# EAGLE design Carte course en cours (EAGLE 8.7.0)
CNAME: https://github.com/heolfief/Course-en-Cours; CREVISION: A; DESIGNER: Heol Fief & Dylan Gageot
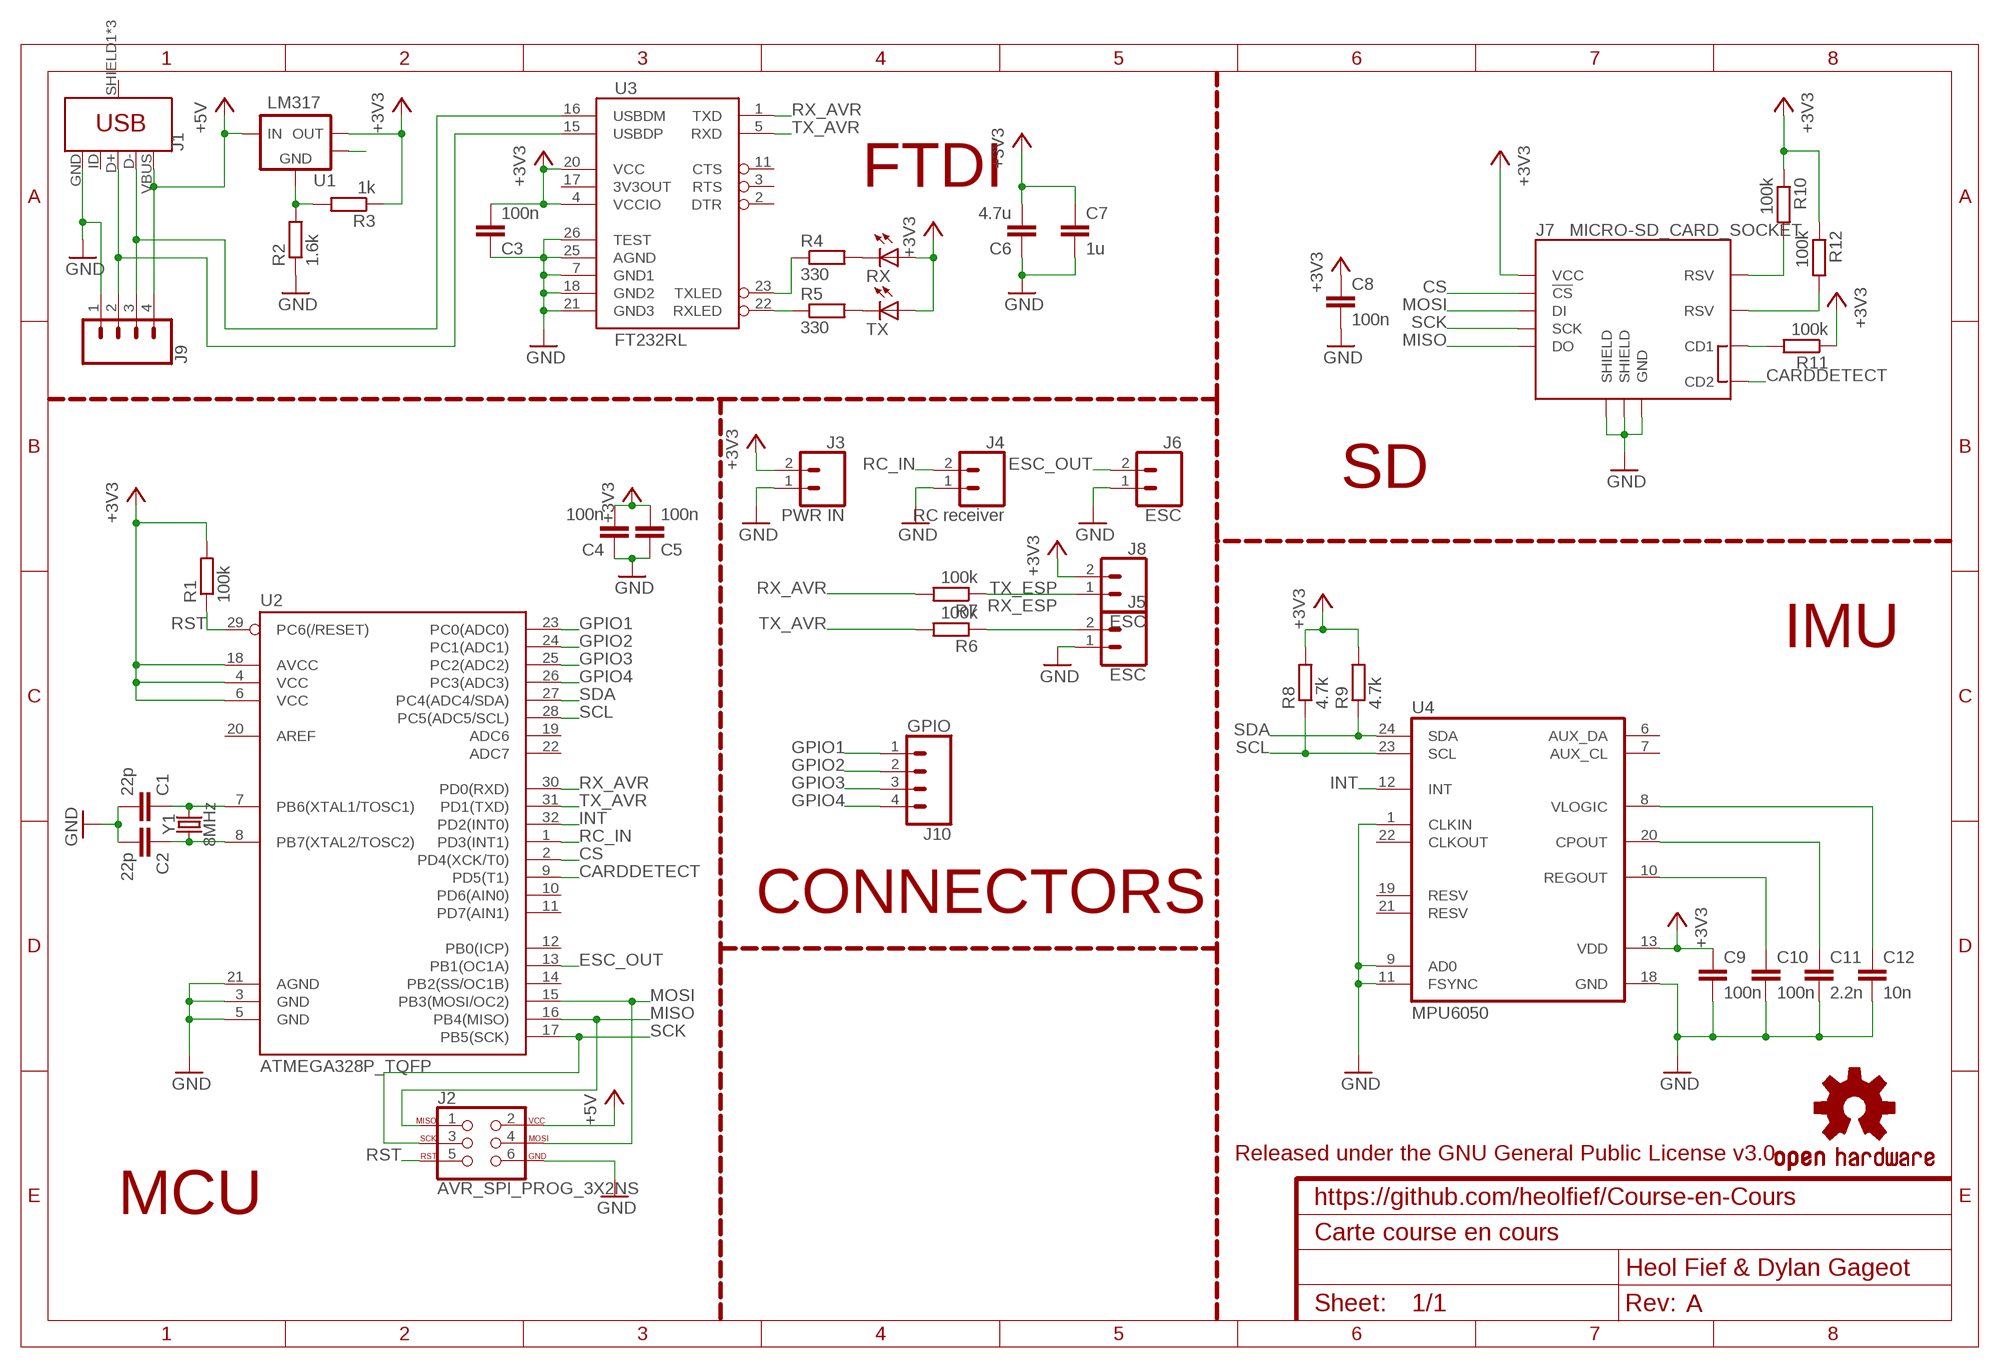
[diagram p0: schematic, sheet 1]

## Parts
C1  22p  C-EUC0805  [C0805]
C2  22p  C-EUC0805  [C0805]
C3  100n  C-EUC0805  [C0805]
C4  100n  C-EUC0805  [C0805]
C5  100n  C-EUC0805  [C0805]
C6  4.7u  C-EUC0805  [C0805]
C7  1u  C-EUC0805  [C0805]
C8  100n  C-EUC0805  [C0805]
C9  100n  C-EUC0805  [C0805]
C10  100n  C-EUC0805  [C0805]
C11  2.2n  C-EUC0805  [C0805]
C12  10n  C-EUC0805  [C0805]
J1  USB_MICRO-B_FEMALE-SMT  [USB-B-MICRO-SMD]
J2  AVR_SPI_PROG_3X2NS  [2X3-NS]
J3  PWR IN  CONN_02  [1X02]
J4  RC receiver  CONN_02  [1X02]
J5  ESC  CONN_02  [1X02]
J6  ESC  CONN_02  [1X02]
J7  MICRO-SD_CARD_SOCKET  [MICRO-SD-SOCKET]
J8  ESC  CONN_02  [1X02]
J9  CONN_04  [1X04]
J10  GPIO  CONN_04  [1X04]
LOGO1  OSHW-LOGOM  [OSHW-LOGO-M]
R1  100k  R-EU_R0805  [R0805]
R2  1.6k  R-EU_R0805  [R0805]
R3  1k  R-EU_R0805  [R0805]
R4  330  R-EU_R0805  [R0805]
R5  330  R-EU_R0805  [R0805]
R6  100k  R-EU_R0805  [R0805]
R7  100k  R-EU_R0805  [R0805]
R8  4.7k  R-EU_R0805  [R0805]
R9  4.7k  R-EU_R0805  [R0805]
R10  100k  R-EU_R0805  [R0805]
R11  100k  R-EU_R0805  [R0805]
R12  100k  R-EU_R0805  [R0805]
RX  LEDCHIPLED_0805  [CHIPLED_0805]
TX  LEDCHIPLED_0805  [CHIPLED_0805]
U1  LM317  LM1117-SOT223  [SOT-223-3]
U2  ATMEGA328P_TQFP  [TQFP32-08]
U3  FT232RL  FT232RL-BASICSSOP  [SSOP28DB]
U4  MPU6050  [HVQFN24_NS]
Y1  8MHz  CRYSTAL-8MHZSMD-5X3.2  [CRYSTAL-SMD-5X3.2-4PAD]

## Nets
+3V3: C3.2 C4.2 C5.2 C6.2 C7.1 C8.1 C9.1 J3.2 J7.VCC J8.2 R1.2 R3.1 R8.2 R9.2 R10.1 R11.1 R12.1 RX.A TX.A U1.2(VOUT) U2.4(VCC) U2.6(VCC) U2.18(AVCC) U3.4(VCCIO) U3.20(VCC) U4.13(VDD)
+5V: J1.VBUS J2.2 J9.4 U1.3(VIN)
CARDDETECT: J7.CD2 U2.9(PD5(T1))
CS: J7.CS(!CS) U2.2(PD4(XCK/T0))
ESC_OUT: J6.2 U2.13(PB1(OC1A))
GND: C1.2 C2.2 C3.1 C4.1 C5.1 C6.1 C7.2 C8.2 C9.2 C10.2 C11.2 C12.2 J1.GND J2.6 J3.1 J4.1 J5.1 J6.1 J7.GND J7.GND1(SHIELD) J7.GND3(SHIELD) J9.1 R2.1 U2.3(GND) U2.5(GND) U2.21(AGND) U3.7(GND1) U3.18(GND2) U3.21(GND3) U3.25(AGND) U3.26(TEST) U4.1(CLKIN) U4.9(AD0) U4.11(FSYNC) U4.18(GND)
GPIO1: J10.1 U2.23(PC0(ADC0))
GPIO2: J10.2 U2.24(PC1(ADC1))
GPIO3: J10.3 U2.25(PC2(ADC2))
GPIO4: J10.4 U2.26(PC3(ADC3))
HEATSINK: U1.4(HEATSINK)
INT: U2.32(PD2(INT0)) U4.12(INT)
MISO: J2.1 J7.DO U2.16(PB4(MISO))
MOSI: J2.4 J7.DI U2.15(PB3(MOSI/OC2))
N$1: R2.2 R3.2 U1.1(GND)
N$2: J1.D- J9.3 U3.16(USBDM)
N$5: C1.1 U2.7(PB6(XTAL1/TOSC1)) Y1.3
N$6: C2.1 U2.8(PB7(XTAL2/TOSC2)) Y1.1
N$7: J1.D+ J9.2 U3.15(USBDP)
N$10: C11.1 U4.20(CPOUT)
N$12: R4.1 U3.23(TXLED)
N$13: R5.1 U3.22(RXLED)
N$14: R4.2 RX.C
N$15: R5.2 TX.C
N$16: C10.1 U4.10(REGOUT)
N$18: C12.1 U4.8(VLOGIC)
N$27: J7.RSV1(RSV) R10.2
N$28: J7.RSV2(RSV) R12.2
N$29: J7.CD1 R11.2
RC_IN: J4.2 U2.1(PD3(INT1))
RST: J2.5 R1.1 U2.29(PC6(/RESET))
RX_AVR: R7.2 U2.30(PD0(RXD)) U3.1(TXD)
RX_ESP: J5.2 R6.1
SCK: J2.3 J7.SCLK(SCK) U2.17(PB5(SCK))
SCL: R8.1 U2.28(PC5(ADC5/SCL)) U4.23(SCL)
SDA: R9.1 U2.27(PC4(ADC4/SDA)) U4.24(SDA)
TX_AVR: R6.2 U2.31(PD1(TXD)) U3.5(RXD)
TX_ESP: J8.1 R7.1
Unconnected: J1.ID J1.SHIELD1(SHIELD) J1.SHIELD2(SHIELD) J1.SHIELD3(SHIELD) U2.10(PD6(AIN0)) U2.11(PD7(AIN1)) U2.12(PB0(ICP)) U2.14(PB2(SS/OC1B)) U2.19(ADC6) U2.20(AREF) U2.22(ADC7) U3.2(DTR) U3.3(RTS) U3.11(CTS) U3.17(3V3OUT) U4.6(AUX_DA) U4.7(AUX_CL) U4.19(RESV) U4.21(RESV) U4.22(CLKOUT)

## Notes on the sheet
- FTDI
- SD
- IMU
- CONNECTORS
- Released under the GNU General Public License v3.0
- MCU

## Library data of the parts
C1-C12 = rcl:C-EU: CAPACITOR, European symbol
J1 = SparkFun-Connectors:USB_MICRO-B: USB Type Micro-B Connector Male/female and PTH/SMT variants SparkFun Products: SparkFun microB USB Breakout <https://www.sparkfun.com/products/12035> SparkFun USB microB Plug Breakout <https://www.sparkfun.com/products/10031> SparkFun ESP8266 Thing <https://www.sparkfun.com/products/13231>; PROD_ID: CONN-11752
J2 = SparkFun-Connectors:AVR_SPI_PROG_3X2: AVR ISP 6 Pin This is the reduced ISP connector for AVR programming. Common on Arduino. This footprint will take up less PCB space and can be used with a 10-pin to 6-pin adapter such as SKU: BOB-08508 **Special note about "TEST_POINT" package. The stop mask is on the top side, so if you want your programming test points to be on the bottom of your board, make sure to place this package on the bottom side of the board. This also ensure that the orientation to program from the bottom side will be correct. SparkFun Products: SparkFun ISP Pogo Adapter <https://www.sparkfun.com/products/11591> - NS Tiny AVR Programmer <https://www.sparkfun.com/products/11801> -PTH
J3-J6 J8 = SparkFun-Connectors:CONN_02: Multi connection point. Often used as Generic Header-pin footprint for 0.1 inch spaced/style header connections On any of the 0.1 inch spaced packages, you can populate with these: Break Away Headers - Straight <https://www.sparkfun.com/products/116> (PRT-00116) Break Away Male Headers - Right Angle <https://www.sparkfun.com/products/553> (PRT-00553) Female Headers <https://www.sparkfun.com/products/115> (PRT-00115) Break Away Headers - Machine Pin <https://www.sparkfun.com/products/117> (PRT-00117) Break Away Female Headers - Swiss Machine Pin <https://www.sparkfun.com/products/743> (PRT-00743) For SCREWTERMINALS and SPRING TERMINALS visit here: Screw Terimnals on SparkFun.com <https://www.sparkfun.com/search/results?term=Screw+Terminals> (5mm/3.5mm/2.54mm spacing) This device is also useful as a general connection point to wire up your design to another part of your project. Our various solder wires solder well into these plated through hole pads. Hook-Up Wire - Assortment (Stranded, 22 AWG) <https://www.sparkfun.com/products/11375> (PRT-11375) Hook-Up Wire - Assortment (Solid Core, 22 AWG) <https://www.sparkfun.com/products/11367> (PRT-11367) View the entire wire category on our website here <https://www.sparkfun.com/categories/141> Special notes: Molex polarized connector foot print use with: PRT-08233 with associated crimp pins and housings. 2.54_SCREWTERM for use with PRT-10571. 3.5mm Screw Terminal footprints for PRT-08084 5mm Screw Terminal footprints for use with PRT-08432
J7 = SparkFun-Connectors:MICRO-SD_CARD_SOCKET: microSD Socket for Transflash Push-push type µSD socket. tDoc lines correctly indicate media card edge positions when inserting (unlocked, locked, depressed). NOTE: CD1 and CD2 are connected internally, and the default detect state of the socket is detect pin to ground. SparkFun Products: WAV Trigger <https://www.sparkfun.com/products/13660> CAN-Bus Shield <https://www.sparkfun.com/products/13262> SparkFun Level Shifing microSD Breakout <https://www.sparkfun.com/products/13743>; PROD_ID: CONN-07820; SF_ID: PRT-00127
J9 J10 = SparkFun-Connectors:CONN_04: Multi connection point. Often used as Generic Header-pin footprint for 0.1 inch spaced/style header connections On any of the 0.1 inch spaced packages, you can populate with these: Break Away Headers - Straight <https://www.sparkfun.com/products/116> (PRT-00116) Break Away Male Headers - Right Angle <https://www.sparkfun.com/products/553> (PRT-00553) Female Headers <https://www.sparkfun.com/products/115> (PRT-00115) Break Away Headers - Machine Pin <https://www.sparkfun.com/products/117> (PRT-00117) Break Away Female Headers - Swiss Machine Pin <https://www.sparkfun.com/products/743> (PRT-00743) For SCREWTERMINALS and SPRING TERMINALS visit here: Screw Terimnals on SparkFun.com <https://www.sparkfun.com/search/results?term=Screw+Terminals> (5mm/3.5mm/2.54mm spacing) This device is also useful as a general connection point to wire up your design to another part of your project. Our various solder wires solder well into these plated through hole pads. Hook-Up Wire - Assortment (Stranded, 22 AWG) <https://www.sparkfun.com/products/11375> (PRT-11375) Hook-Up Wire - Assortment (Solid Core, 22 AWG) <https://www.sparkfun.com/products/11367> (PRT-11367) View the entire wire category on our website here <https://www.sparkfun.com/categories/141> Special notes: Molex polarized connector foot print use with SKU : PRT-08231 with associated crimp pins and housings. 1MM SMD Version SKU: PRT-10208; PROD_ID: CONN-09696
LOGO1 = SparkFun-Aesthetics:OSHW-LOGO: Open-Source Hardware (OSHW) Logo This logo indicates the piece of hardware it is found on incorporates a OSHW license and/or adheres to the definition of open source hardware found here: http://freedomdefined.org/OSHW
R1-R12 = rcl:R-EU_: RESISTOR, European symbol
RX TX = led:LED: LED OSRAM: - CHIPLED LG R971, LG N971, LY N971, LG Q971, LY Q971, LO R971, LY R971 LH N974, LH R974 LS Q976, LO Q976, LY Q976 LO Q996 - Hyper CHIPLED LW Q18S LB Q993, LB Q99A, LB R99A - SideLED LS A670, LO A670, LY A670, LG A670, LP A670 LB A673, LV A673, LT A673, LW A673 LH A674 LY A675 LS A676, LA A676, LO A676, LY A676, LW A676 LS A679, LY A679, LG A679 - Hyper Micro SIDELED® LS Y876, LA Y876, LO Y876, LY Y876 LT Y87S - SmartLED LW L88C, LW L88S LB L89C, LB L89S, LG L890 LS L89K, LO L89K, LY L89K LS L896, LA L896, LO L896, LY L896 - TOPLED LS T670, LO T670, LY T670, LG T670, LP T670 LSG T670, LSP T670, LSY T670, LOP T670, LYG T670 LG T671, LOG T671, LSG T671 LB T673, LV T673, LT T673, LW T673 LH T674 LS T676, LA T676, LO T676, LY T676, LB T676, LH T676, LSB T676, LW T676 LB T67C, LV T67C, LT T67C, LS T67K, LO T67K, LY T67K, LW E67C LS E67B, LA E67B, LO E67B, LY E67B, LB E67C, LV E67C, LT E67C LW T67C LS T679, LY T679, LG T679 LS T770, LO T770, LY T770, LG T770, LP T770 LB T773, LV T773, LT T773, LW T773 LH T774 LS E675, LA E675, LY E675, LS T675 LS T776, LA T776, LO T776, LY T776, LB T776 LHGB T686 LT T68C, LB T68C - Hyper Mini TOPLED® LB M676 - Mini TOPLED Santana® LG M470 LS M47K, LO M47K, LY M47K Source: http://www.osram.convergy.de LUXEON: - LUMILED® LXK2-PW12-R00, LXK2-PW12-S00, LXK2-PW14-U00, LXK2-PW14-V00 LXK2-PM12-R00, LXK2-PM12-S00, LXK2-PM14-U00 LXK2-PE12-Q00, LXK2-PE12-R00, LXK2-PE12-S00, LXK2-PE14-T00, LXK2-PE14-U00 LXK2-PB12-K00, LXK2-PB12-L00, LXK2-PB12-M00, LXK2-PB14-N00, LXK2-PB14-P00, LXK2-PB14-Q00 LXK2-PR12-L00, LXK2-PR12-M00, LXK2-PR14-Q00, LXK2-PR14-R00 LXK2-PD12-Q00, LXK2-PD12-R00, LXK2-PD12-S00 LXK2-PH12-R00, LXK2-PH12-S00 LXK2-PL12-P00, LXK2-PL12-Q00, LXK2-PL12-R00 Source: www.luxeon.com KINGBRIGHT: KA-3528ASYC Source: www.kingbright.com
U1 = bt_regulator:LM1117: LDO Voltage Regulator NCP1117 Output Current in Excess of 1.0 A 1.2 V Maximum Dropout Voltage at 800 mA Over Temperature Fixed Output Voltages of 1.5, 1.8, 1.9, 2.0, 2.5, 2.85, 3.3, 5.0, and 12 V Adjustable Output Voltage Option No Minimum Load Requirement for Fixed Voltage Output Devices Reference/Output Voltage Trimmed to ±1.0% Current Limit, Safe Operating and Thermal Shutdown Protection Operation to 20 V Input NCV Prefix for Automotive and Other Applications Requiring Unique Site and Control Change Requirements; AEC−Q100 Qualified and PPAP Capable datasheet.pdf <http://www.onsemi.com/pub/Collateral/NCP1117-D.PDF> LM1117 Available in 1.8 V, 2.5 V, 3.3 V, 5 V, and adjustable versions Output Current 800 mA Current Limiting and Thermal Protection Space-Saving SOT-223 and WSON Packages Line Regulation 0.2% (Maximum) Load Regulation 0.4% (Maximum) Temperature: LM1117: 0°C to 125°C; LM1117I: −40°C to 125°C LM1117 (Rev. N) is a series of low dropout voltage regulators of 1.2V at 800mA of load current. It has the same pin-out as Texas Instruments' industry standard LM317. The LM1117-N is available in an adjustable version, available in five fixed voltages, 1.8V, 2.5V, 2.85V, 3.3V, and 5V. The LM1117-N offers current limiting and thermal shutdown. Its circuit includes a zener trimmed to within ±1%. datasheet.pdf <http://www.ti.com/lit/ds/symlink/lm1117.pdf>
U2 = SparkFun-IC-Microcontroller:ATMEGA328P_TQFP: Popular 328P in QFP Storefront component: ATmega328 - TQFP <https://www.sparkfun.com/products/13448> (COM-13448) Datasheet <http://www.sparkfun.com/datasheets/Components/SMD/ATMega328.pdf> SparkFun Products SparkFun RedBoard - Programmed with Arduino <https://www.sparkfun.com/products/12757> (DEV-12757) Arduino Pro Mini 328 - 5V/16MHz <https://www.sparkfun.com/products/11113> (DEV-11113) Arduino Pro Mini 328 - 3.3V/8MHz <https://www.sparkfun.com/products/11114> (DEV-11114) SparkFun OpenLog <https://www.sparkfun.com/products/13712> (DEV-13712) SparkFun MicroView - OLED Arduino Module <https://www.sparkfun.com/products/12923> (DEV-12923) SparkFun Digital Sandbox <https://www.sparkfun.com/products/12651> (DEV-12651) SparkFun PicoBoard <https://www.sparkfun.com/products/11888> (WIG-11888) Arduino Fio <https://www.sparkfun.com/products/10116> (DEV-10116) LilyPad Arduino 328 Main Board <https://www.sparkfun.com/products/13342> (DEV-13342) SparkFun RedStick <https://www.sparkfun.com/products/13741> (DEV-13741) LilyPad MP3 <https://www.sparkfun.com/products/11013> (DEV-11013) LilyPad Arduino SimpleSnap <https://www.sparkfun.com/products/10941> (DEV-10941) SparkFun Stepoko <https://www.sparkfun.com/products/13899> (ROB-13899) SparkFun Geiger Counter <https://www.sparkfun.com/products/11345> (SEN-11345) SparkFun EL Sequencer <https://www.sparkfun.com/products/12781> (COM-12781) Arduino Pro 328 - 5V/16MHz <https://www.sparkfun.com/products/10915> (DEV-10915) CryptoCape <https://www.sparkfun.com/products/12773> (DEV-12773) SparkFun IR Thermometer Evaluation Board - MLX90614 <https://www.sparkfun.com/products/10740> (SEN-10740) SparkFun RedBot Mainboard <https://www.sparkfun.com/products/12097> (ROB-12097) Arduino Pro 328 - 3.3V/8MHz <https://www.sparkfun.com/products/10914> (DEV-10914) SparkFun Block for Intel® Edison - Arduino <https://www.sparkfun.com/products/13036> (DEV-13036) SparkFun Simon Says - Surface Mount Soldering Kit <https://www.sparkfun.com/products/10935> (KIT-10935) SparkFun 7-Segment Serial Display - Red <https://www.sparkfun.com/products/11441> (COM-11441) SparkFun 7-Segment Serial Display - White <https://www.sparkfun.com/products/11629> (COM-11629) SparkFun 7-Segment Serial Display - Yellow <https://www.sparkfun.com/products/11443> (COM-11443) SparkFun 7-Segment Serial Display - Kelly Green <https://www.sparkfun.com/products/11440> (COM-11440) SparkFun 7-Segment Serial Display - Blue <https://www.sparkfun.com/products/11442> (COM-11442) SparkFun OpenSegment Serial Display - 20mm (Blue) <https://www.sparkfun.com/products/11647> (COM-11647) SparkFun OpenSegment Serial Display - 20mm (Green) <https://www.sparkfun.com/products/11646> (COM-11646) SparkFun OpenSegment Serial Display - 20mm (White) <https://www.sparkfun.com/products/11648> (COM-11648) SparkFun OpenSegment Serial Display - 20mm (Red) <https://www.sparkfun.com/products/11644> (COM-11644) SparkFun OpenSegment Serial Display - 20mm (Yellow) <https://www.sparkfun.com/products/11645> (COM-11645) SparkFun OpenSegment Shield <https://www.sparkfun.com/products/13190> (DEV-13190); PROD_ID: IC-09069
U3 = SparkFun-IC-Comms:FT232RL-BASIC: FT232RL USB UART This is the simplified version of the FT232RL unit. Only what you need, nothing you don't. FT232RL 4th Generation USB UART (USB <-> Serial) Controller. Datasheet <http://www.sparkfun.com/datasheets/IC/FT232R_v104.pdf> SparkFun Products Component <https://www.sparkfun.com/products/650> (COM-00650) SparkFun RedBot Mainboard <https://www.sparkfun.com/products/12097> (ROB-12097) SparkFun FTDI Basic Breakout - 5V <https://www.sparkfun.com/products/9716> (DEV-09716) SparkFun FTDI Basic Breakout - 3.3V <https://www.sparkfun.com/products/9873> (DEV-09873) Bus Pirate - v3.6a <https://www.sparkfun.com/products/12942> (TOL-12942) SparkFun USB to Serial Breakout - FT232RL <https://www.sparkfun.com/products/12731> (BOB-12731) SparkFun PicoBoard <https://www.sparkfun.com/products/11888> (WIG-11888) SparkFun RFID USB Reader <https://www.sparkfun.com/products/9963> (SEN-09963) LilyPad FTDI Basic Breakout - 5V <https://www.sparkfun.com/products/10275> (DEV-10275) SparkFun Stepoko <https://www.sparkfun.com/products/13899> (ROB-13899); PROD_ID: IC-00870
U4 = invensense:MPU6050: 6-Axis Motion Sensor I2C interface only
Y1 = SparkFun-Clocks:CRYSTAL-8MHZ: 8MHz Crystal Datasheet Example <http://www.futureelectronics.com/en/technologies/electromechanical/timing-devices/crystals/Pages/6008189-ABM3B-8.000MHZ-B2-T.aspx?IM=0> Frequency: 8MHz Frequency Tolerance: ±20ppm Load Capacitance: 18pF SparkFun Products: Pro Micro -3.3V/8MHz <https://www.sparkfun.com/products/12587> WAV Trigger <https://www.sparkfun.com/products/13660>; PROD_ID: XTAL-09431

## Board
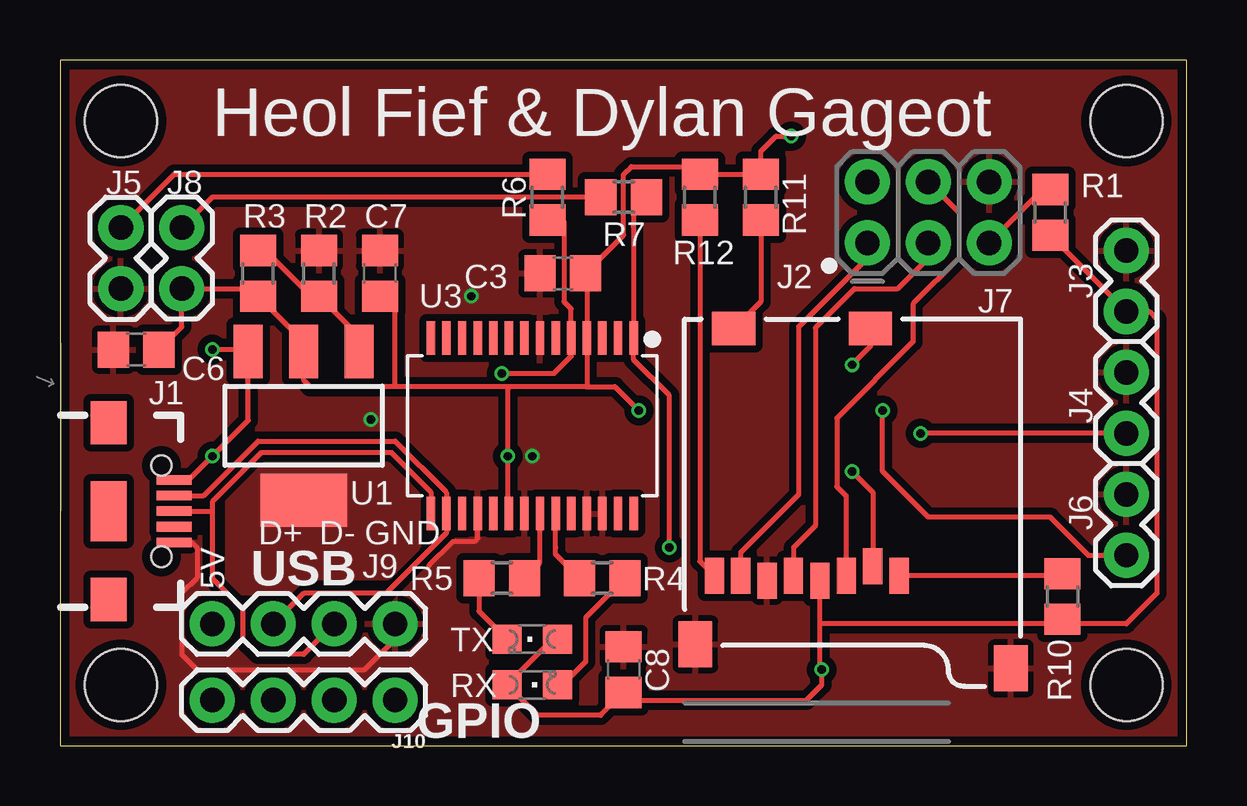
[diagram p1: board, top side]
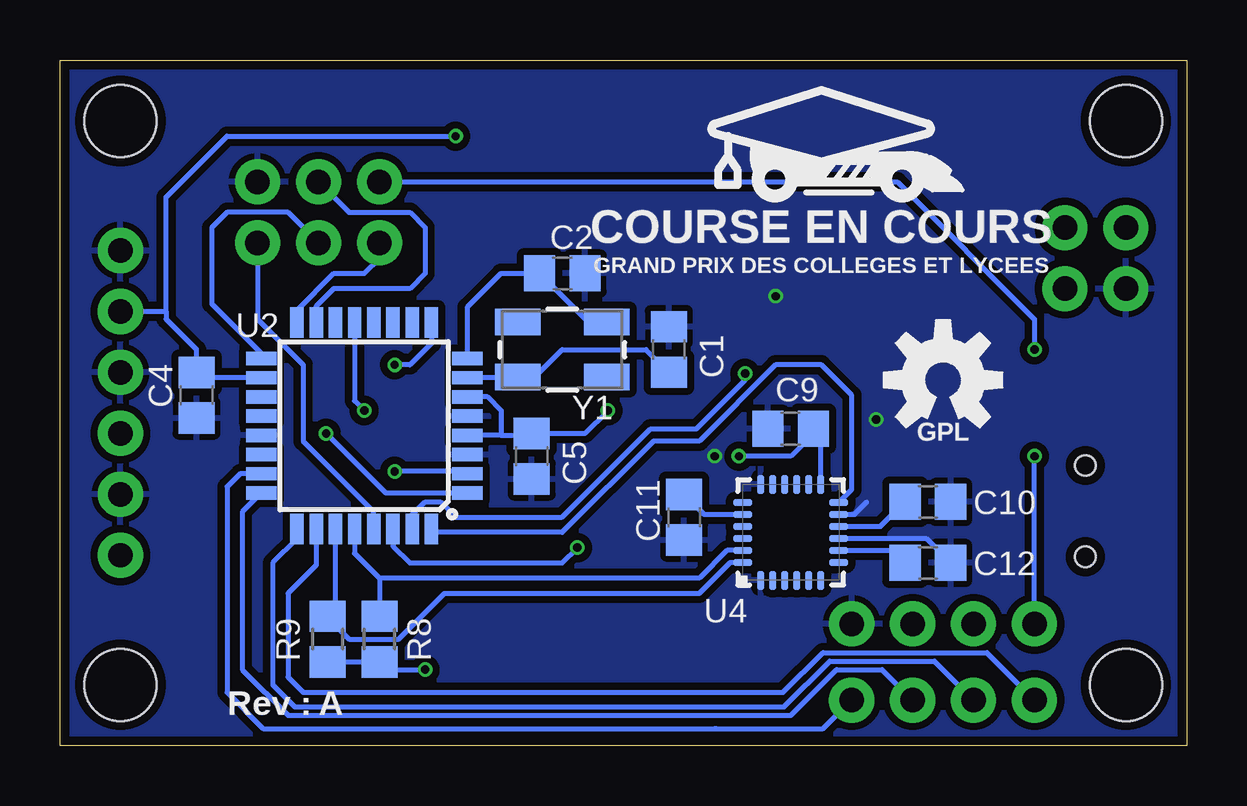
[diagram p2: board, bottom side, seen from below]

Size 46.97 x 28.57 mm. Coordinates in mm from the lower left corner, seen from the top.
Outline: 0,0 46.97,0 46.97,28.57 0,28.57 0,0
Copper layers (1*16): Top 0.035559375mm / dielectric 1.6mm / Bottom 0.035559375mm
Design rules "oshpark-2layer": minimum track width 6mil, minimum drill 10mil, track to track 6mil, track to pad 6mil, pad to pad 6mil, via to via 6mil, smd to smd 6mil, copper to edge 15mil, drill to drill 6mil, minimum pad ring 5mil, minimum via ring 5mil, stop-mask expansion 2.5mil, vias tented up to drill 0mil, thermal gap 10mil
Holes 3 mm at 2.54,2.54 44.45,2.54 2.54,26.04 44.45,26.04

### Footprints (pad centres in the part's own frame; a part is rotated, then mirrored left to right if it is on the bottom)
C0805 = smd 1.3 x 1.5: 1 -0.95,0; 2 0.95,0
USB-B-MICRO-SMD = smd 1.45 x 0.4: D+ 2.725,0; D- 2.725,0.65; GND 2.725,-1.3; ID 2.725,-0.65; VBUS 2.725,1.3 | smd 1.5 x 1.8: SHIELD1 0,3.685; SHIELD2 0,-3.685 | smd 1.5 x 2.5: SHIELD3 0,0 | hole 0.85: 2.2,1.9; 2.2,-1.9
2X3-NS = drill 1.016 pad 1.88: 1 -2.54,-1.27; 2 -2.54,1.27; 3 0,-1.27; 4 0,1.27; 5 2.54,-1.27; 6 2.54,1.27
1X02 = drill 1.016 pad 1.88: 1 0,0; 2 2.54,0
MICRO-SD-SOCKET = smd 1.8 x 1.4: CD1 -2.05,0.4; CD2 -7.75,0.4 | smd 0.8 x 1.5: CS -7.84,10.3; DI -6.74,10.7; DO -2.34,10.7; GND -3.44,10.9; RSV1 -8.94,10.7; RSV2 -1.24,10.7; SCLK -4.54,10.7; VCC -5.64,10.9 | smd 1.4 x 1.9: GND1 -13.6,14.55; GND3 -0.45,13.55
1X04 = drill 1.016 pad 1.88: 1 0,0; 2 2.54,0; 3 5.08,0; 4 7.62,0
R0805 = smd 1.3 x 1.5: 1 -0.95,0; 2 0.95,0
CHIPLED_0805 = smd 1.2 x 1.2: A 0,-1.05; C 0,1.05
SOT-223-3 = smd 1.219 x 2.235: 1 -2.311,-3.099; 2 0,-3.099; 3 2.311,-3.099 | smd 3.6 x 2.2: 4 0,3.099
TQFP32-08 = smd 1.27 x 0.559: 1 -4.293,2.8; 2 -4.293,2; 3 -4.293,1.2; 4 -4.293,0.4; 5 -4.293,-0.4; 6 -4.293,-1.2; 7 -4.293,-2; 8 -4.293,-2.8; 17 4.293,-2.8; 18 4.293,-2; 19 4.293,-1.2; 20 4.293,-0.4; 21 4.293,0.4; 22 4.293,1.2; 23 4.293,2; 24 4.293,2.8 | smd 0.559 x 1.27: 9 -2.8,-4.293; 10 -2,-4.293; 11 -1.2,-4.293; 12 -0.4,-4.293; 13 0.4,-4.293; 14 1.2,-4.293; 15 2,-4.293; 16 2.8,-4.293; 25 2.8,4.293; 26 2,4.293; 27 1.2,4.293; 28 0.4,4.293; 29 -0.4,4.293; 30 -1.2,4.293; 31 -2,4.293; 32 -2.8,4.293
SSOP28DB = smd 0.348 x 1.397: 1 -4.225,-3.656; 2 -3.575,-3.656; 3 -2.925,-3.656; 4 -2.275,-3.656; 5 -1.625,-3.656; 6 -0.975,-3.656; 7 -0.325,-3.656; 8 0.325,-3.656; 9 0.975,-3.656; 10 1.625,-3.656; 11 2.275,-3.656; 12 2.925,-3.656; 13 3.575,-3.656; 14 4.225,-3.656; 15 4.225,3.656; 16 3.575,3.656; 17 2.925,3.656; 18 2.275,3.656; 19 1.625,3.656; 20 0.975,3.656; 21 0.325,3.656; 22 -0.325,3.656; 23 -0.975,3.656; 24 -1.625,3.656; 25 -2.275,3.656; 26 -2.925,3.656; 27 -3.575,3.656; 28 -4.225,3.656
HVQFN24_NS = smd 0.8 x 0.3: 1 -2,1.25; 2 -2,0.75; 3 -2,0.25; 4 -2,-0.25; 5 -2,-0.75; 6 -2,-1.25; 13 2,-1.25; 14 2,-0.75; 15 2,-0.25; 16 2,0.25; 17 2,0.75; 18 2,1.25 | smd 0.3 x 0.8: 7 -1.25,-2; 8 -0.75,-2; 9 -0.25,-2; 10 0.25,-2; 11 0.75,-2; 12 1.25,-2; 19 1.25,2; 20 0.75,2; 21 0.25,2; 22 -0.25,2; 23 -0.75,2; 24 -1.25,2
CRYSTAL-SMD-5X3.2-4PAD = smd 1.9 x 1.1: 1 -1.85,-1.15; 2 1.85,-1.15; 3 1.85,1.15; 4 -1.85,1.15

### Placement (x,y rotation side)
C1  21.59,16.51 90 bottom
C2  26.04,19.68 0 bottom
C3  20.95,19.68 0 top
C4  41.27,14.61 90 bottom
C5  27.3,12.06 90 bottom
C6  3.17,16.51 0 top
C7  13.34,19.68 90 top
C8  23.5,3.17 90 top
C9  16.51,13.21 180 bottom
C10  10.79,10.16 0 bottom
C11  20.95,9.53 270 bottom
C12  10.79,7.62 0 bottom
J1  2.03,9.78 0 top
J2  36.2,22.23 0 top
J3  44.45,20.64 270 top
J4  44.45,15.56 270 top
J5  2.54,19.05 90 top
J6  44.45,10.48 270 top
J7  26.04,17.78 180 top
J8  5.08,21.59 270 top
J9  13.97,5.08 180 top
J10  13.97,1.91 180 top
LOGO1  10.16,15.24 0 bottom
R1  41.27,22.23 270 top
R2  10.79,19.68 270 top
R3  8.26,19.68 90 top
R4  22.61,6.99 0 top
R5  18.41,6.99 180 top
R6  20.32,22.86 270 top
R7  23.5,22.86 0 top
R8  33.66,4.45 270 bottom
R9  35.81,4.45 270 bottom
R10  41.78,6.22 90 top
R11  29.21,22.86 270 top
R12  26.67,22.86 270 top
RX  19.68,2.54 270 top
TX  19.68,4.45 90 top
U1  10.16,13.34 180 top
U2  34.29,13.34 180 bottom
U3  19.68,13.34 180 top
U4  16.51,8.89 90 bottom
Y1  26.04,16.51 180 bottom

### Tracks (layer width: path | path; a pad name or v marks a point on that pad's centre or on a via)
+3V3  (via drill 0.35)
  Top 0.203: C6.2 5.08,17.46 J8.2 7.94,19.05 R3.1 10.16,16.83 U1.2 10.16,15.24 10.44,14.96 13.97,14.96 | R11.1 R12.1 26.36,23.81 26.04,24.13 23.81,24.13 23.5,23.81 23.5,21.27 C3.2 21.96,19.63 U3.4 21.96,15.02 21.91,14.96 | R11.1 29.52,23.5 | U3.20 18.71,9.53 18.67,9.57 v18.67,12.06 18.67,14.9 18.73,14.96 | TX.A 20.54,4.45 RX.A 19.91,1.27 22.54,1.27 23.34,2.06 | C8.1 23.34,2.06 | 31.68,5.08 J7.VCC | 23.34,2.06 23.5,1.91 31.11,1.91 31.75,2.54 v31.75,3.17 31.68,3.25 31.68,5.08 | 41.75,5.24 R10.1 | 41.75,5.24 41.59,5.08 31.68,5.08 | R11.1 29.21,24.77 29.84,25.4 v30.48,25.4 | 41.75,5.24 41.91,5.08 44.45,5.08 45.72,6.35 45.72,17.78 45.4,18.1 J3.2 R1.2 | 18.73,14.96 13.97,14.96 | 13.97,14.96 13.97,18.1 C7.1 | 21.91,14.96 18.73,14.96 | 21.91,14.96 23.14,14.96 v24.13,13.97
  Bottom 0.203: R9.2 R8.2 33.34,3.17 v31.75,3.17 | 42.55,18.1 42.55,17.78 41.27,16.51 C4.2 41.05,15.34 U2.18 | 28.57,12.94 27.39,12.94 C5.2 25.09,13.02 v24.13,13.97 | 28.57,12.94 U2.4 | v30.48,25.4 40.01,25.4 42.55,22.86 42.55,18.1 | U2.6 29.14,14.54 28.57,13.97 28.57,12.94 | U4.13 15.26,13.04 C9.1 15.56,13.02 16.51,12.06 v18.67,12.06 | J3.2 42.55,18.1
+5V  (via drill 0.35)
  Top 0.203: J1.VBUS 5.36,11.08 v6.35,12.06 7.85,13.56 U1.3 7.77,16.51 v6.35,16.51
  Bottom 0.203: J9.4 v6.35,12.06 | J2.2 12.06,23.5 6.35,17.78 v6.35,16.51
CARDDETECT  (via drill 0.35)
  Top 0.203: J7.CD2 33.78,16.64 v33.02,15.88
  Bottom 0.203: U2.9 31.49,16.77 32.38,15.88 v33.02,15.88
CS  (via drill 0.35)
  Top 0.203: v33.02,11.43 33.88,10.57 J7.CS
  Bottom 0.203: U2.2 30.09,11.43 v33.02,11.43
ESC_OUT  (via drill 0.35)
  Top 0.203: J6.2 42.86,7.94 41.27,9.53 36.2,9.53 34.29,11.43 v34.29,13.97
  Bottom 0.203: U2.13 34.69,14.37 v34.29,13.97
GND  (via drill 0.35)
  Top 0.203: U3.18 17.41,8.65 17.27,8.51 16.38,8.51 15.37,7.49 | J1.GND 5.49,8.48 5.71,8.26 5.71,6.99 5.08,6.35 5.08,3.81 5.71,3.17 12.7,3.17 13.97,4.45 J9.1
  Bottom 0.203: U4.11 13.86,9.64 13.34,10.16 | U4.9 10.87,8.64 C12.2
  other vias: 17.14,18.73 12.95,13.59 19.68,12.06
  pour Top (isolate 0.305, rank 2): 0,28.57 46.99,28.57 46.99,0 0,0
  pour Bottom (isolate 0.305, rank 2): 0,28.57 46.99,28.57 46.99,0 0,0
GPIO1
  Bottom 0.203: U2.23 39.47,11.34 40.01,10.79 40.01,2.22 38.49,0.71 19.68,0.71 19.61,0.71 15.16,0.71 J10.1
GPIO2
  Bottom 0.203: U2.24 39.37,9.75 39.37,3.17 37.47,1.27 16.51,1.27 14.61,3.17 12.7,3.17 J10.2
GPIO3
  Bottom 0.203: U2.25 37.09,8.63 38.1,7.62 38.1,2.54 37.19,1.63 16.79,1.63 14.88,3.53 10.52,3.53 J10.3
GPIO4
  Bottom 0.203: U2.26 36.29,7.53 37.47,6.35 37.47,2.86 36.83,2.22 23.5,2.22 23.18,2.22 16.83,2.22 15.16,3.89 8.33,3.89 J10.4
HEATSINK
  pour Top (no thermals): 6.99,10.16 8.57,11.75 13.65,11.75 14.92,10.48 14.92,8.26 13.65,6.99 10.16,6.99 9.53,6.35 7.62,6.35 6.99,6.99
INT
  Bottom 0.203: U4.12 13.97,10.68 13.97,14.61 15.24,15.88 17.14,15.88 20.32,12.7 22.23,12.7 26.04,8.89 31.34,8.89 U2.32
MISO
  Top 0.203: J2.1 33.66,20.32 30.8,17.46 30.8,10.48 28.38,8.05 J7.DO
  Bottom 0.203: U2.16 37.09,18.16 35.56,19.68 34.29,19.68 33.66,20.32 J2.1
MOSI
  Top 0.203: J7.DI 32.77,10.4 32.38,10.79 32.38,13.65 35.56,16.83 35.56,18.41 37.47,20.32 37.47,22.23 J2.4
  Bottom 0.203: J2.4 34.92,22.23 32.38,22.23 31.75,21.59 31.75,19.68 32.38,19.05 35.56,19.05 36.29,18.32 U2.15
N$1
  Top 0.203: U1.1 12.47,17.06 R2.2 10.48,19.05 10.16,19.05 8.57,20.64 R3.2
N$2
  Top 0.203: J1.D- 5.98,10.43 8.26,12.7 13.97,12.7 16.11,10.56 U3.16 16.11,8.87 13.59,6.35 10.16,6.35 J9.3
N$5
  Bottom 0.203: U2.7 29.97,15.36 Y1.3 27.18,15.36 26.04,16.51 22.54,16.51 C1.1
N$6
  Bottom 0.203: U2.8 30,18.26 28.57,19.68 C2.1 24.96,17.66 Y1.1
N$7
  Top 0.203: U3.15 15.46,10.57 13.81,12.22 8.41,12.22 6.35,10.16 6.35,9.78 | J9.2 10.16,3.81 8.26,3.81 7.62,4.45 7.62,5.71 6.35,6.99 6.35,9.78 | J1.D+ 6.35,9.78
N$10
  Bottom 0.203: C11.1 20.12,9.64 U4.20
N$12
  Top 0.203: 20.66,8.26 U3.23 | 20.66,8.26 20.66,8.23 | R4.1 20.66,7.98 20.66,8.26
N$13
  Top 0.203: R5.1 20.01,7.63 U3.22
N$14
  Top 0.203: RX.C 20.95,2.54 21.91,3.49 21.91,5.34 R4.2
N$15
  Top 0.203: R5.2 17.46,5.62 TX.C
N$16
  Bottom 0.203: U4.10 12.77,9.14 C10.1
N$18
  Bottom 0.203: U4.8 12.27,8.14 C12.1
N$27
  Top 0.203: R10.2 41.69,7.08 J7.RSV1
N$28
  Top 0.203: R12.2 26.67,7.68 J7.RSV2
N$29
  Top 0.203: R11.2 29.21,18.5 J7.CD1
RC_IN  (via drill 0.35)
  Top 0.203: J4.2 v35.88,13.02
  Bottom 0.203: v35.88,13.02 33.4,10.54 U2.1
RST
  Top 0.203: J2.5 40.95,23.18 R1.1
  Bottom 0.203: J2.5 38.73,17.78 36.83,15.88 36.83,12.7 33.89,9.76 U2.29
RX_AVR  (via drill 0.35)
  Top 0.203: v25.4,8.26 25.4,14.61 23.91,16.09 U3.1 23.91,21.59 23.91,21.69 23.91,22.32 R7.2
  Bottom 0.203: U2.30 33.09,8.32 32.38,7.62 26.04,7.62 v25.4,8.26
RX_ESP
  Top 0.203: J5.2 4.76,23.81 R6.1
SCK
  Top 0.203: J7.SCLK 30.57,8.26 31.48,9.16 31.48,17.41 33.12,19.05 34.92,19.05 36.2,20.32 J2.3
  Bottom 0.203: J2.3 37.47,22.23 40.01,22.23 40.64,21.59 40.64,18.41 38.58,16.36 U2.17
SCL
  Bottom 0.203: U4.23 19.16,8.14 20.32,6.99 33.66,6.99 | U2.28 34.69,8.02 33.66,6.99 | 33.66,6.99 R8.1
SDA
  Bottom 0.203: 35.56,5.08 R9.1 | U4.24 19.03,7.64 20.32,6.35 30.94,6.35 32.85,4.45 34.92,4.45 35.81,5.33 R9.1 | R9.1 35.49,5.72 U2.27
TX_AVR  (via drill 0.35)
  Top 0.203: R6.2 21,21.86 21,18.51 21.31,18.2 U3.5 21.31,16.23 20.6,15.52 v18.41,15.52
  Bottom 0.203: U2.31 32.29,9.62 31.75,10.16 31.11,10.16 30.48,9.53 26.04,9.53 22.35,13.21 20.45,13.21 18.41,15.24 v18.41,15.52
TX_ESP
  Top 0.203: J8.1 6.35,22.86 R7.1

### Text on the board
bPlace: COURSE EN COURS | GRAND PRIX DES COLLEGES ET LYCEES | GPL | Rev :
tNames: Heol Fief & Dylan Gageot | D+ | D- | GND | 5V | USB | GPIO